# Altium project HW_ADHERENT_SYSCTRL_R1.PrjPcb (part 1 of 2)
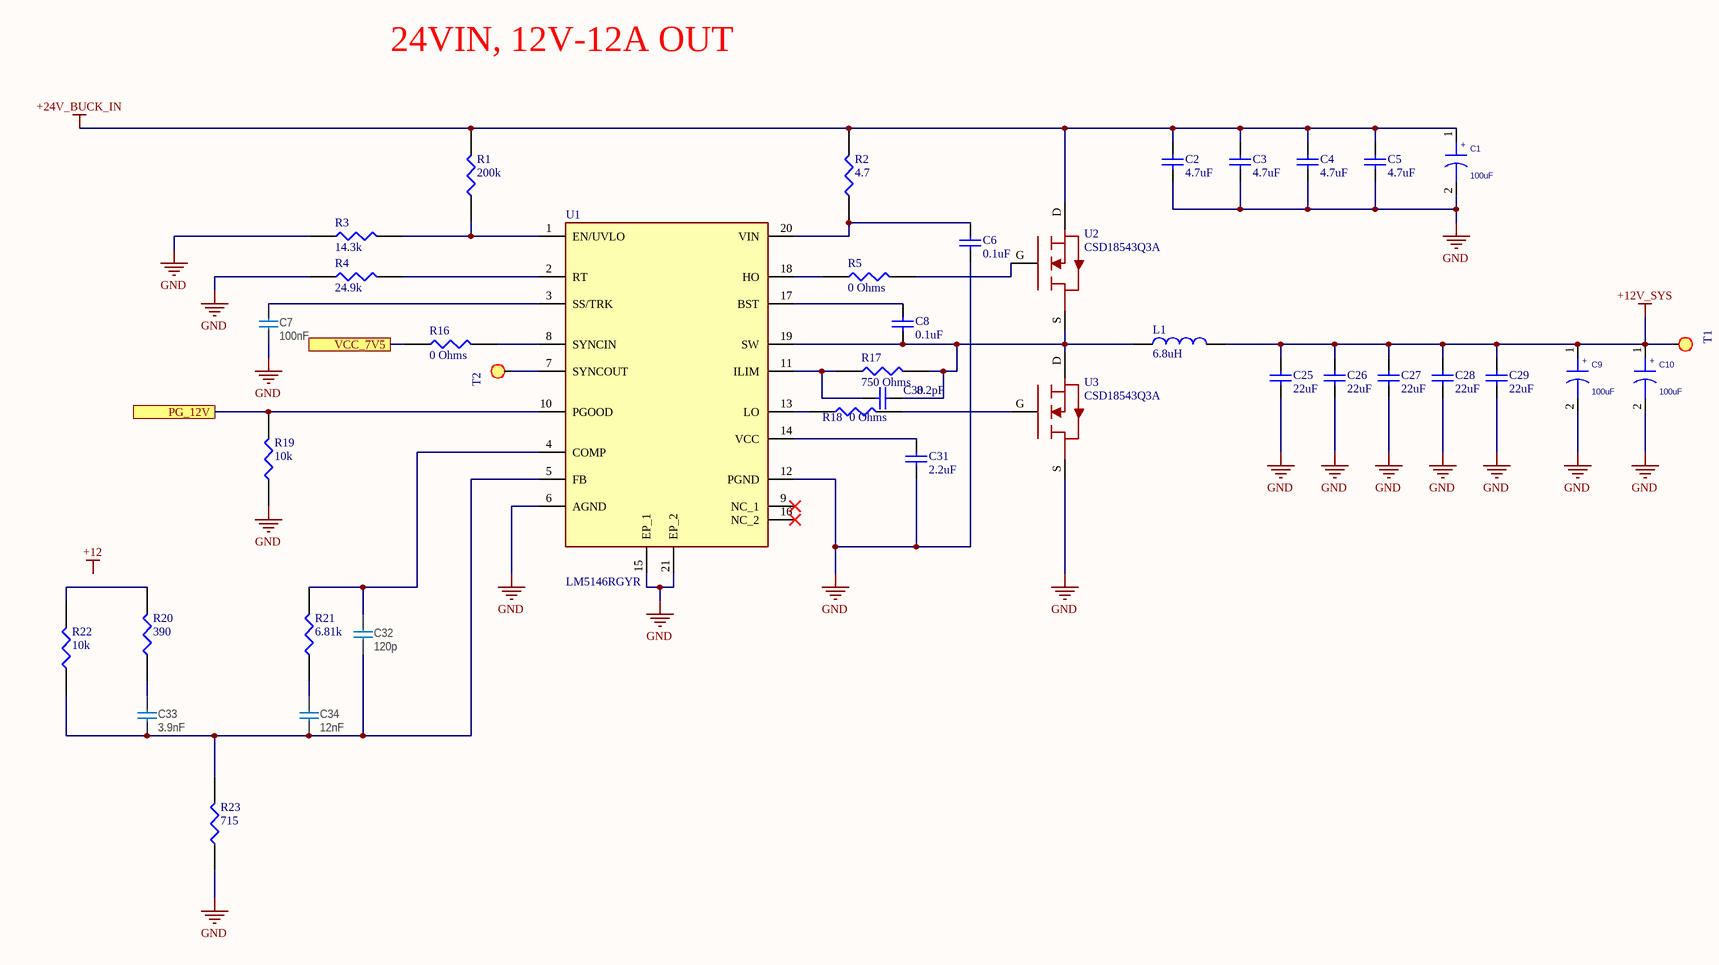
[diagram p0: 03_POWER1.SchDoc]
Project: HW_ADHERENT_SYSCTRL_R1; Title: HW_ADHERENT_SYSCTRL_R1; TitleParameter: HW_ADHERENT_SYSCTRL_R1
12 sheets, 218 parts. Net scope: flat (ports and power ports of the same name join across sheets).
Board file: HW_ADHERENT_SYSCTRL_R1.PcbDoc
Sheets:
  02_BLOCK_DIAGRAM.SchDoc
  03_POWER1.SchDoc
  04_POWER_2.SchDoc
  POWER_3.SchDoc
  POWER_4.SchDoc
  POWER_5.SchDoc
  05_MCU.SchDoc
  06_DRIVER.SchDoc
  DRIVER_2.SchDoc
  09_CONNECTOR.SchDoc
  DRIVER_3.SchDoc
  DRIVER4.SchDoc

## Sheet 02_BLOCK_DIAGRAM.SchDoc: HW_ADHERENT_SYSCTRL_R1
size A3; Organization: ASISGUARD; Address1: Kemalpasa, Kemalpasa Cd. No:290 D:292H, 35060 Bornova/Izmir/Turkey; SheetNumber: 2; SheetTotal: 6

### Notes on the sheet
- Proje/Project:
- Sayfa Adı/Document Name:
- Çizilme Tarihi/Drawing Date
- Umit KAYACIK
- Tasarlayan/Designed By
- Sayfa/Sheet:
- Revision:
- of
- Son Güncelleme/Last Edit Date
- Kontrol eden/Checked By
- Onaylayan/Approved By
- Boyut/Size:
- Varyant/Variant:
- Dil/Language:
- A3
- ENG

## Sheet 03_POWER1.SchDoc: HW_ADHERENT_SYSCTRL_R1
size A3; Organization: ASISGUARD; Address1: Kemalpasa, Kemalpasa Cd. No:290 D:292H, 35060 Bornova/Izmir/Turkey; SheetNumber: 3; SheetTotal: 14

### Parts
C1  100uF  [SMD 10.3x10.3x10.0mm]
C2  4.7uF  [CAP1206]
C3  4.7uF  [CAP1206]
C4  4.7uF  [CAP1206]
C5  4.7uF  [CAP1206]
C6  0.1uF  [0402_C]
C7  100nF  [CAPC0603X03L_C]
C8  0.1uF  [0402_C]
C9  100uF  [SMD 10.3x10.3x10.0mm]
C10  100uF  [SMD 10.3x10.3x10.0mm]
C25  22uF  [CAP1206]
C26  22uF  [CAP1206]
C27  22uF  [CAP1206]
C28  22uF  [CAP1206]
C29  22uF  [CAP1206]
C30  value 8.2pF  [SMC0603]  (hidden comment: CAP CER 8.2PF 50V C0G/NPO 0603)
C31  value 2.2uF  [SMC0603]  (hidden comment: CAP CER 4.7UF 25V X5R 0603)
C32  120p  [CAPC0603X03L_C]
C33  3.9nF  [CAPC0603X03L_C]
C34  12nF  [CAPC0603X03L_C]
L1  6.8uH  [SRU10386R2Y]
R1  200k  [0805]
R2  4.7  [0805]
R3  14.3k  [0805]
R4  24.9k  [0805]
R5  0 Ohms  [0805]
R16  0 Ohms  [0805]
R17  750 Ohms  [0805]
R18  0 Ohms  [0805]
R19  10k  [0805]
R20  390  [0805]
R21  6.81k  [0805]
R22  10k  [0805]
R23  715  [0805]
T1  SMD  [TEST_POINT]  (value not drawn)
T2  SMD  [TEST_POINT]  (value not drawn)
U1  LM5146RGYR  [LM5146RGYR]
U2  CSD18543Q3A  [CSD18543Q3A]
U3  CSD18543Q3A  [CSD18543Q3A]

### Ports
PG_12V, VCC_7V5

### Nets
+12V_SYS: C9.1 C10.1 C25.2 C26.2 C27.2 C28.2 C29.2 L1.2 T1.1(TP)
+24V_BUCK_IN: C1.1 C2.2 C3.2 C4.2 C5.2 R1.2 R2.2 U2.D
GND: C1.2 C2.1 C3.1 C4.1 C5.1 C6.1 C7.1 C9.2 C10.2 C25.1 C26.1 C27.1 C28.1 C29.1 C31.1 R3.1 R4.1 R19.1 R23.1 U1.6(AGND) U1.12(PGND) U1.15(EP_1) U1.21(EP_2) U3.S
NetC6_2: C6.2 R2.1 U1.20(VIN)
NetC7_2: C7.2 U1.3(SS/TRK)
NetC8_1: C8.1 C30.2 L1.1 R17.2 U1.19(SW) U2.S U3.D
NetC8_2: C8.2 U1.17(BST)
NetC30_1: C30.1 R17.1 U1.11(ILIM)
NetC31_2: C31.2 U1.14(VCC)
NetC32_1: C32.1 C33.1 C34.1 R22.1 R23.2 U1.5(FB)
NetC32_2: C32.2 R21.2 U1.4(COMP)
NetC33_2: C33.2 R20.1
NetC34_2: C34.2 R21.1
NetR1_1: R1.1 R3.2 U1.1(EN/UVLO)
NetR4_2: R4.2 U1.2(RT)
NetR5_1: R5.1 U1.18(HO)
NetR5_2: R5.2 U2.G
NetR16_1: R16.1 ; port VCC_7V5
NetR16_2: R16.2 U1.8(SYNCIN)
NetR18_1: R18.1 U1.13(LO)
NetR18_2: R18.2 U3.G
NetR19_2: R19.2 U1.10(PGOOD) ; port PG_12V
NetR20_2: R20.2 R22.2
NetT2_1: T2.1(TP) U1.7(SYNCOUT)

Not connected (* = marked no-connect by the designer): U1 9(NC_1)* 16(NC_2)*

### Notes on the sheet
- 24VIN, 12V-12A OUT
- Labels drawn without touching a wire or pin: +12
- Proje/Project:
- Sayfa Adı/Document Name:
- Çizilme Tarihi/Drawing Date
- Umit KAYACIK
- Tasarlayan/Designed By
- Sayfa/Sheet:
- Revision:
- of
- Son Güncelleme/Last Edit Date
- Kontrol eden/Checked By
- Onaylayan/Approved By
- Boyut/Size:
- Varyant/Variant:
- Dil/Language:
- A3
- ENG
- (in symbol 150uF-6.3V-20%-AL-LOESR-SMD_5x6_5) +

### Library data of the parts
C1 C9 C10 = 150uF-6.3V-20%-AL-LOESR-SMD_5x6_5: CAP ALUM POLY 100UF 20% 50V SMD; Manufacturer: Nichicon; Manufacturer Part Number: PCV1H101MCL2GS; Value: 100uF; Supplier Part Number: 493-4558-1-ND
C2-C5 = CAP1206_4.7uF_100V: 4.7 µF ±10% 100V Ceramic Capacitor X7S 1206 (3216 Metric); Manufacturer Part Number: 12061Z475KAT2A; Value: 4.7uF 100V; Order Code: DIGI : 445-180362-1-ND
C6 C8 = Cap: CAP CER 0.1UF 50V X7R 0402; Manufacturer: TDK Corporation; Manufacturer Part Number: C1005X7R1H104K050BB; Value: 0.1uF; Supplier Part Number: 445-5932-1-ND
C7 = C0201-100n: Capacitor, X5R, ±10%; Manufacturer: N.A.; Part number IPS: 00000001248, 00000002505; Part number Norautron: 262071862; Part number NEMS: 100200078; Note: 16V; Pad Count: 2; Component Status: Active; Part Number: C0201-100n; Manufacturer Part Number: N.A.; ComponentLink1URL: N.A.; ComponentLink1Description: Datasheet; ComponentLink2URL: N.A.; ComponentLink2Description: Supplier link; HelpURL: N.A.; Footprint Doc: 0201; LatestRevisionDate: 2017-11-09; Published: 2014-11-13; Value: 100nF; Supplier 1: N.A.; Supplier Part Number 1: N.A.; Supplier 2: N.A.; Supplier Part Number 2: N.A.; Artikkelnr Noca: N.A.; PartId: 100200078; Component Class: Capacitors; Author: rsk
C25-C29 = CAP1206_22uF_35V: 22 µF ±20% 35V Ceramic Capacitor X5R 1206 (3216 Metric); Manufacturer Part Number: C3216X5R1V226M160AC; Value: 22uF 35V; Order Code: DIGI : 445-180362-1-ND
C30 = CAP0603_8.2PF_50V: 8.2 pF ±0.25pF 50V Ceramic Capacitor C0G, NP0 0603 (1608 Metric); Manufacturer Part Number: CC0603CRNPO9BN8R2; Order Code: DIGI : 311-3865-2-ND; LCSC Manufacturer Part Number: CC0603CRNPO9BN8R2; LCSC Part Number: C277519
C31 = CAP0603_2.2UF_16V: 2.2 µF ±10% 16V Ceramic Capacitor X7S 0603 (1608 Metric); Manufacturer Part Number: GRT188C71C225KE13D; Order Code: DIGI: 490-GRT188C71C225KE13DTR-ND
C32-C34 = C0201-100n: Capacitor, X5R, ±10%; Manufacturer: N.A.; Part number IPS: 00000001248, 00000002505; Part number Norautron: 262071862; Part number NEMS: 100200078; Value: 100nF; Note: 16V; Pad Count: 2; Component Status: Active; Part Number: C0201-100n; Manufacturer Part Number: N.A.; ComponentLink1URL: N.A.; ComponentLink1Description: Datasheet; ComponentLink2URL: N.A.; ComponentLink2Description: Supplier link; HelpURL: N.A.; Footprint Doc: 0201; LatestRevisionDate: 2017-11-09; Published: 2014-11-13; Supplier 1: N.A.; Supplier Part Number 1: N.A.; Supplier 2: N.A.; Supplier Part Number 2: N.A.; Artikkelnr Noca: N.A.; PartId: 100200078; Component Class: Capacitors; Author: rsk
L1 = IND_6.2uH_4A: 6.2 µH Shielded Drum Core, Wirewound Inductor 4 A 16.5mOhm Nonstandard; Manufacturer_Name: Bourns; Manufacturer Part Number: SRU1038-6R2Y; Geometry.Height: 6.1mm; Mouser Part Number: 652-SRU1038-6R2Y; Mouser Price/Stock: https://www.mouser.co.uk/ProductDetail/Bourns/SRU1038-6R2Y?qs=q9ZR8LvBB%2FuBaClm0822pQ%3D%3D; Arrow Part Number: SRU1038-6R2Y; Arrow Price/Stock: https://www.arrow.com/en/products/sru1038-6r2y/bourns; Datasheet Link: https://www.mouser.com/datasheet/2/54/sru1038-1391493.pdf
R1-R5 R16-R23 = 0805W8F2003T5E: -55℃~+155℃ 125mW 150V 200kΩ Thick Film Resistor ±1% ±100ppm/℃ 0805 Chip Resistor - Surface Mount ROHS
T1 T2 = TP_15: DESIG: testing PAD; FAB: NA; VAL: NOT POPULATED; PCB Footprint: test0_8-smd; REF: NA
U1 = LM5146RGYR: Buck Regulator Positive Output Step-Down DC-DC Controller IC 20-VQFN (3.5x4.5); Manufacturer: Texas Instruments; Supplier: Digi; 296-LM5146RGYRDKR-ND
U2 U3 = CSD18543Q3A: N-Channel 60 V 60A (Tc) 66W (Tc) Surface Mount 8-VSONP (3x3.3)

## Sheet 04_POWER_2.SchDoc: HW_ADHERENT_SYSCTRL_R1
size A3; SheetNumber: 4; SheetTotal: 13
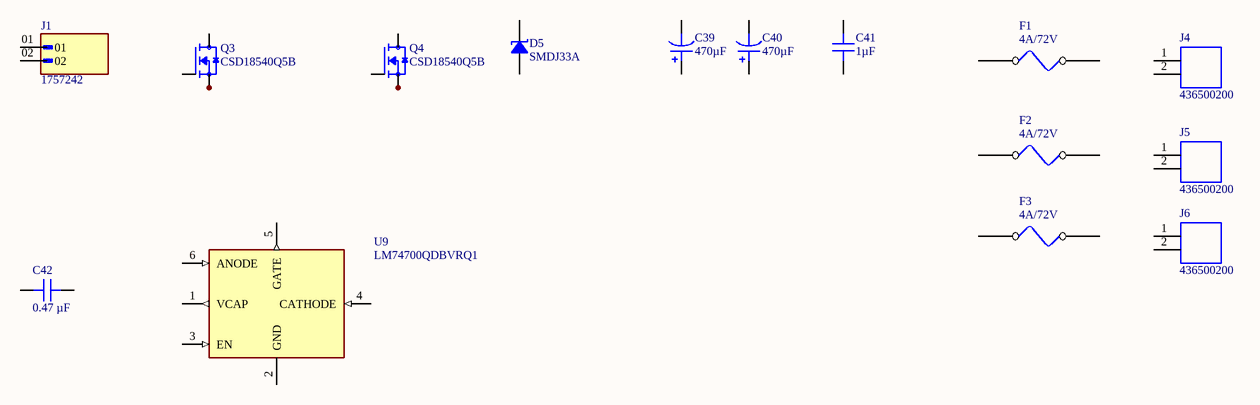
[diagram p1: 04_POWER_2.SchDoc]

### Parts
C39  470µF  [CAP TH ALUM ELEC D10.00mm S5.00mm H22.00mm]
C40  470µF  [CAP TH ALUM ELEC D10.00mm S5.00mm H22.00mm]
C41  1µF  [CAP 0805_2012]
C42  0.47 µF  [CAP 0603_1608]
D5  SMDJ33A  [DO214AB SMC]
F1  4A/72V  [F1206]
F2  4A/72V  [F1206]
F3  4A/72V  [F1206]
J1  1757242  [PHOENIX_1757242]
J4  436500200  [CONN_SD-43650-001_02_MOL]
J5  436500200  [CONN_SD-43650-001_02_MOL]
J6  436500200  [CONN_SD-43650-001_02_MOL]
Q3  CSD18540Q5B  [TRANS_CSD18540Q5B]
Q4  CSD18540Q5B  [TRANS_CSD18540Q5B]
U9  LM74700QDBVRQ1  [SOT95P280X145-6N/LM74700QDBVRQ1]

### Nets
NetQ3_1: Q3.1(S) Q3.2(S) Q3.3(S)
NetQ4_1: Q4.1(S) Q4.2(S) Q4.3(S)

Not connected (* = marked no-connect by the designer): C39 1 2; C40 1 2; C41 1 2; C42 1 2; D5 1 2; F1 1 2; F2 1 2; F3 1 2; J1 01 02; J4 1 2; J5 1 2; J6 1 2; Q3 4(G) 5_6_7_8(D); Q4 4(G) 5_6_7_8(D); U9 1(VCAP) 2(GND) 3(EN) 4(CATHODE) 5(GATE) 6(ANODE)

### Library data of the parts
C39 C40 = ECA-1HM471: CAP ALUM 470UF 20% 50V RADIAL; manufacturer: Panasonic Electronic Components; Lifetime @ Temp.: 2000 Hrs @ 85°C; Polarization: Polar; Ripple Current @ High Frequency: 1.105A @ 10kHz; Ripple Current @ Low Frequency: 650mA @ 120Hz; Part Number: ECA-1HM471; Applications: General Purpose; Capacitance: 470µF; componentlink1description: Datasheet; componentlink1url: //media.digikey.com/pdf/Data%20Sheets/Panasonic%20Electronic%20Components/ECA-xxM%20Series,TypeA.pdf; componentlink2description: DigiKey Link; componentlink2url: http://digikey.com/product-detail/en/panasonic-electronic-components/ECA-1HM471/P5185-ND/245044; Device Package: Radial, Can; Height - Seated (Max): 0.866" (22.00mm); lastupdated: 2.09.2020 01:31:40; Lead Spacing: 0.197" (5.00mm); Lifecycle Status: Active; Minimum Order: 1; Mounting Type: Through Hole; Operating Temperature: -40°C ~ 85°C; Package / Case: Radial, Can; packaging: Bulk; partid: 13256; Part Status: Active; price: 0.64; series: M; Size / Dimension: 0.394" Dia (10.00mm); Supplier 1: DigiKey; Supplier Part Number 1: P5185-ND; Tolerance: ±20%; value: 470µF; Voltage - Rated: 50V
C41 = 08051C105K4T2A: CAP CER 1UF 100V X7R 0805; manufacturer: AVX Corporation; Tolerance: ±10%; Part Number: 08051C105K4T2A; Capacitance: 1µF; Applications: Automotive; componentlink1description: Datasheet; componentlink1url: http://datasheets.avx.com/AutoMLCC.pdf; componentlink2description: DigiKey Link; componentlink2url: http://digikey.com/product-detail/en/avx-corporation/08051C105K4T2A/478-12142-1-ND/9374711; Device Package: 0805 (2012 Metric); lastupdated: 2.09.2020 01:04:22; Lifecycle Status: Active; Minimum Order: 1; Mounting Type: Surface Mount, MLCC; Operating Temperature: -55°C ~ 125°C; Package / Case: 0805 (2012 Metric); packaging: TapeAndReel; partid: 13414; Part Status: Active; price: 0.09; Ratings: AEC-Q200; series: -; Size / Dimension: 0.079" L x 0.049" W (2.01mm x 1.25mm); Supplier 1: DigiKey; Supplier Part Number 1: 478-12142-1-ND; Temperature Coefficient: X7R; value: 1µF; Voltage - Rated: 100V
C42 = CL10A474KA8NNNC: CAP CER 0.47UF 25V X5R 0603; manufacturer: Samsung Electro-Mechanics; Tolerance: ±10%; Part Number: CL10A474KA8NNNC; Capacitance: 0.47 µF; Applications: General Purpose; componentlink1description: Datasheet; componentlink1url: http://www.samsungsem.com/kr/support/product-search/mlcc/CL10A474KA8NNNC.jsp; componentlink2description: DigiKey Link; componentlink2url: https://www.digikey.com/en/products/detail/samsung-electro-mechanics/CL10A474KA8NNNC/3887553; Device Package: 0603 (1608 Metric); lastupdated: 6.04.2026 19:23:45; Lifecycle Status: Active; Minimum Order: 1; Mounting Type: Surface Mount, MLCC; Operating Temperature: -55°C ~ 85°C; Package / Case: 0603 (1608 Metric); packaging: TapeAndReel; partid: 4224; Part Status: Active; price: 0.01; series: CL; Size / Dimension: 0.063" L x 0.031" W (1.60mm x 0.80mm); Supplier 1: DigiKey; Supplier Part Number 1: 1276-1895-1-ND; Temperature Coefficient: X5R; Thickness (Max): 0.035" (0.90mm); value: 0.47 µF; Voltage - Rated: 25V
D5 = SMDJ33A: TVS DIODE 33VWM 53.3VC DO214AB; Manufacturer: Littelfuse Inc.; Current - Peak Pulse (10/1000µs): 56.3A; Power Line Protection: No; Power - Peak Pulse: 3000W (3kW); Type: Zener; Unidirectional Channels: 1; Voltage - Breakdown (Min): 36.7V; Voltage - Clamping (Max) @ Ipp: 53.3V; Voltage - Reverse Standoff (Typ): 33V; Part Number: SMDJ33A; Applications: General Purpose; ComponentLink1Description: Datasheet; ComponentLink1URL: https://www.littelfuse.com/~/media/electronics/datasheets/tvs_diodes/littelfuse_tvs_diode_smdj_datasheet.pdf.pdf; ComponentLink2Description: DigiKey Link; ComponentLink2URL: https://www.digikey.com/en/products/detail/littelfuse-inc/SMDJ33A/1835325; LastUpdated: 5.04.2026 20:34:02; Lifecycle Status: Active; Minimum Order: 1; Mounting Type: Surface Mount; Operating Temperature: -65°C ~ 150°C (TJ); Package / Case: DO-214AB, SMC; Packaging: TapeAndReel; PartId: 7128; Part Status: Active; Price: 0.33; Series: SMDJ; Supplier 1: DigiKey; Supplier Part Number 1: SMDJ33ACT-ND; Supplier Device Package: DO-214AB (SMCJ)
F1-F3 = Fuse: Fuse,Resettable 4A 75V,SMD 1206,TLC; Manufacturer P/N: F12F4; Myir P/N: 20801.00014; Datasheet: F12F Series.pdf; Reserve Value: 4A; Manufacturer: TLC; Part Type: Resettable Fuse; PCB Footprint: F1206
J1 = 1757242: Pluggable Header 5.08mm 12AWG 320V 12A 2 Position COMBICON MSTBA Series | Phoenix Contact 1757242; SnapEDA_Link: https://www.snapeda.com/parts/1757242/Phoenix+Contact/view-part/?ref=snap; Package: None; Value: *; MF: Phoenix Contact; MP: 1757242; Check_prices: https://www.snapeda.com/parts/1757242/Phoenix+Contact/view-part/?ref=eda
J4-J6 = 436500200: Connector Header Through Hole, Right Angle 2 position 0.118 (3.00mm); MF: Molex; SnapEDA_Link: https://www.snapeda.com/parts/436500200/Molex/view-part/?ref=snap; Package: None; Value: *; MP: 436500200; Check_prices: https://www.snapeda.com/parts/436500200/Molex/view-part/?ref=eda
Q3 Q4 = CSD18540Q5B: 60-V, N channel NexFETâ„¢ power MOSFET, single SON 5 mm x 6 mm, 2.2 mOhm; MF: Texas Instruments; SnapEDA_Link: https://www.snapeda.com/parts/CSD18540Q5B/Texas+Instruments/view-part/?ref=snap; Package: VSON-CLIP-8 Texas Instruments; Value: *; MP: CSD18540Q5B; Check_prices: https://www.snapeda.com/parts/CSD18540Q5B/Texas+Instruments/view-part/?ref=eda
U9 = LM74700QDBVRQ1: OR Controller N+1 ORing Controller N-Channel 1:1 SOT-23-6

## Sheet POWER_3.SchDoc: HW_ADHERENT_SYSCTRL_R1
size A; SheetNumber: 5; SheetTotal: 14
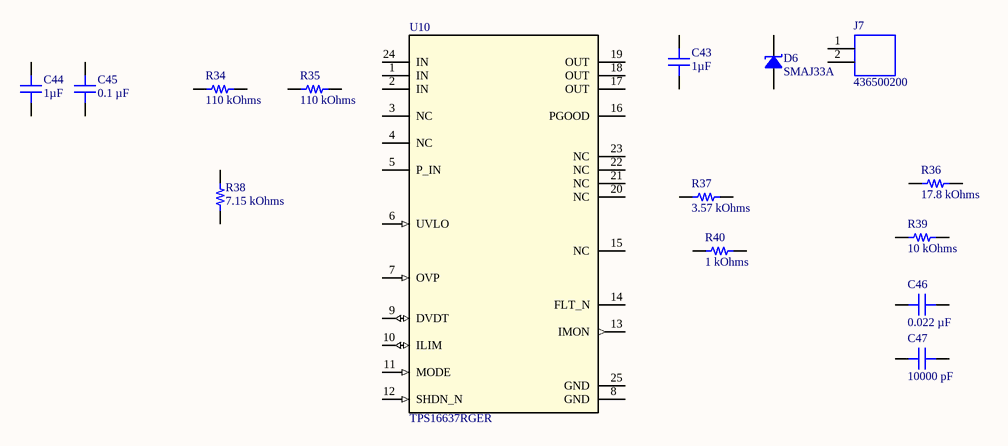
[diagram p2: POWER_3.SchDoc]

### Parts
C43  1µF  [CAP 0805_2012]
C44  1µF  [CAP 0805_2012]
C45  0.1 µF  [CAP 0603_1608]
C46  0.022 µF  [CAP 0603_1608]
C47  10000 pF  [CAP 0603_1608]
D6  SMAJ33A  [DO214AC SMA]
J7  436500200  [CONN_SD-43650-001_02_MOL]
R34  110 kOhms  [RES 0603_1608]
R35  110 kOhms  [RES 0603_1608]
R36  17.8 kOhms  [RES 0603_1608]
R37  3.57 kOhms  [RES 0603_1608]
R38  7.15 kOhms  [RES 0603_1608]
R39  10 kOhms  [RES 0603_1608]
R40  1 kOhms  [RES 0603_1608]
U10  TPS16637RGER  [RGE0024H]

### Nets

Not connected (* = marked no-connect by the designer): C43 1 2; C44 1 2; C45 1 2; C46 1 2; C47 1 2; D6 1 2; J7 1 2; R34 1 2; R35 1 2; R36 1 2; R37 1 2; R38 1 2; R39 1 2; R40 1 2; U10 1(IN) 2(IN) 3(NC) 4(NC) 5(P_IN) 6(UVLO) 7(OVP) 8(GND) 9(DVDT) 10(ILIM) 11(MODE) 12(SHDN_N) 13(IMON) 14(FLT_N) 15(NC) 16(PGOOD) 17(OUT) 18(OUT) 19(OUT) 20(NC) 21(NC) 22(NC) 23(NC) 24(IN) 25(GND)

### Library data of the parts
C43 C44 = 08051C105K4T2A: as C41 on sheet 04_POWER_2; Part Number: 08051C105K4T2A; Capacitance: 1µF; Applications: Automotive; componentlink1description: Datasheet; componentlink1url: http://datasheets.avx.com/AutoMLCC.pdf; componentlink2description: DigiKey Link; componentlink2url: http://digikey.com/product-detail/en/avx-corporation/08051C105K4T2A/478-12142-1-ND/9374711; Device Package: 0805 (2012 Metric); lastupdated: 2.09.2020 01:04:22; Lifecycle Status: Active; Minimum Order: 1; Mounting Type: Surface Mount, MLCC; Operating Temperature: -55°C ~ 125°C; Package / Case: 0805 (2012 Metric); packaging: TapeAndReel; partid: 13414; Part Status: Active; price: 0.09; Ratings: AEC-Q200; series: -; Size / Dimension: 0.079" L x 0.049" W (2.01mm x 1.25mm); Supplier 1: DigiKey; Supplier Part Number 1: 478-12142-1-ND; Temperature Coefficient: X7R; value: 1µF; Voltage - Rated: 100V
C45 = HMK107BJ104KA-T: CAP CER 0.1UF 100V X5R 0603; manufacturer: Taiyo Yuden; Tolerance: ±10%; Part Number: HMK107BJ104KA-T; Capacitance: 0.1 µF; Applications: SMPS Filtering; componentlink1description: Datasheet; componentlink1url: https://ds.yuden.co.jp/TYCOMPAS/ut/detail?pn=HMK107BJ104KA-T  &u=M; componentlink2description: DigiKey Link; componentlink2url: https://www.digikey.com/en/products/detail/taiyo-yuden/HMK107BJ104KA-T/4970694; Device Package: 0603 (1608 Metric); Features: High Voltage; lastupdated: 6.04.2026 19:23:31; Lifecycle Status: Active; Minimum Order: 1; Mounting Type: Surface Mount, MLCC; Operating Temperature: -55°C ~ 85°C; Package / Case: 0603 (1608 Metric); packaging: TapeAndReel; partid: 8162; Part Status: Active; price: 0.01; series: M; Size / Dimension: 0.063" L x 0.031" W (1.60mm x 0.80mm); Supplier 1: DigiKey; Supplier Part Number 1: 587-5862-1-ND; Temperature Coefficient: X5R; Thickness (Max): 0.035" (0.90mm); value: 0.1 µF; Voltage - Rated: 100V
C46 = CL10B223KO8WPNC: CAP CER 22NF 16V X7R 0603; manufacturer: Samsung Electro-Mechanics; Tolerance: ±10%; Part Number: CL10B223KO8WPNC; Capacitance: 0.022 µF; Applications: Automotive; componentlink1description: Datasheet; componentlink1url: https://mm.digikey.com/Volume0/opasdata/d220001/medias/docus/5458/CL10B223KO8WPNC_Spec.pdf; componentlink2description: DigiKey Link; componentlink2url: https://www.digikey.com/en/products/detail/samsung-electro-mechanics/CL10B223KO8WPNC/20498563; Device Package: 0603 (1608 Metric); Features: Open Mode; lastupdated: 6.04.2026 19:17:38; Lifecycle Status: Active; Minimum Order: 1; Mounting Type: Surface Mount, MLCC, Epoxy; Operating Temperature: -55°C ~ 125°C; Package / Case: 0603 (1608 Metric); packaging: TapeAndReel; partid: 64880; price: 0.01; Ratings: AEC-Q200; series: CL; Size / Dimension: 0.063" L x 0.031" W (1.60mm x 0.80mm); Supplier 1: DigiKey; Supplier Part Number 1: 1276-CL10B223KO8WPNCCT-ND; Temperature Coefficient: X7R; Thickness (Max): 0.035" (0.88mm); value: 0.022 µF; Voltage - Rated: 16V
C47 = C0603C103M4REC7411: CAP CER 0603 10NF 16V X7R 20%; manufacturer: KEMET; Part Number: C0603C103M4REC7411; Capacitance: 10000 pF; Applications: ESD Protection; componentlink1description: Datasheet; componentlink1url: https://connect.kemet.com:7667/gateway/IntelliData-ComponentDocumentation/1.0/download/datasheet/C0603C103M4REC7411; componentlink2description: DigiKey Link; componentlink2url: https://www.digikey.com/en/products/detail/kemet/C0603C103M4REC7411/8645113; Device Package: 0603 (1608 Metric); lastupdated: 6.04.2026 19:20:47; Lifecycle Status: Active; Minimum Order: 1; Mounting Type: Surface Mount, MLCC; Operating Temperature: -55°C ~ 125°C; Package / Case: 0603 (1608 Metric); packaging: TapeAndReel; partid: 52195; Part Status: Active; price: 0.01; series: ESD SMD Comm X7R; Size / Dimension: 0.063" L x 0.031" W (1.60mm x 0.80mm); Supplier 1: DigiKey; Supplier Part Number 1: 399-C0603C103M4REC7411CT-ND; Temperature Coefficient: X7R; Thickness (Max): 0.034" (0.87mm); Tolerance: ±20%; value: 10000 pF; Voltage - Rated: 16V
D6 = SMAJ33A: TVS DIODE 33VWM 53.3VC DO214AC; Manufacturer: Littelfuse Inc.; Current - Peak Pulse (10/1000µs): 7.5A; Power Line Protection: No; Power - Peak Pulse: 400W; Type: Zener; Unidirectional Channels: 1; Voltage - Breakdown (Min): 36.7V; Voltage - Clamping (Max) @ Ipp: 53.3V; Voltage - Reverse Standoff (Typ): 33V; Part Number: SMAJ33A; Applications: General Purpose; ComponentLink1Description: Datasheet; ComponentLink1URL: https://www.littelfuse.com/~/media/electronics/datasheets/tvs_diodes/littelfuse_tvs_diode_smaj_datasheet.pdf.pdf; ComponentLink2Description: DigiKey Link; ComponentLink2URL: https://www.digikey.com/en/products/detail/littelfuse-inc/SMAJ33A/762296; LastUpdated: 5.04.2026 20:34:16; Lifecycle Status: Active; Minimum Order: 1; Mounting Type: Surface Mount; Operating Temperature: -65°C ~ 150°C (TJ); Package / Case: DO-214AC, SMA; Packaging: TapeAndReel; PartId: 5718; Part Status: Active; Price: 0.06; Series: SMAJ; Supplier 1: DigiKey; Supplier Part Number 1: SMAJ33ALFCT-ND; Supplier Device Package: DO-214AC (SMA)
J7 = 436500200: as J4 on sheet 04_POWER_2; SnapEDA_Link: https://www.snapeda.com/parts/436500200/Molex/view-part/?ref=snap; Package: None; Value: *; MP: 436500200; Check_prices: https://www.snapeda.com/parts/436500200/Molex/view-part/?ref=eda
R34 R35 = RMCF0603FT110K: RES 110K OHM 1% 1/10W 0603; Manufacturer: Stackpole Electronics Inc; Power (Watts): 0.1W, 1/10W; Temperature Coefficient: ±100ppm/°C; Part Number: RMCF0603FT110K; Value: 110 kOhms; ComponentLink1Description: Datasheet; ComponentLink1URL: https://www.seielect.com/catalog/sei-packaging.pdf; ComponentLink2Description: DigiKey Link; ComponentLink2URL: https://www.digikey.com/en/products/detail/stackpole-electronics-inc/RMCF0603FT110K/1761310; Composition: Thick Film; Device Package: 0603 (1608 Metric); Features: Automotive AEC-Q200; Height - Seated (Max): 0.022" (0.55mm); LastUpdated: 9.02.2024 20:43:13; Lifecycle Status: Active; Minimum Order: 1; Number of Terminations: 2; Operating Temperature: -55°C ~ 155°C; Package / Case: 0603 (1608 Metric); Packaging: CutTape; PartId: 10728; Part Status: Active; Price: 0.01; Ratings: AEC-Q200; Resistance: 110 kOhms; Series: RMCF; Size / Dimension: 0.061" L x 0.031" W (1.55mm x 0.80mm); Supplier 1: DigiKey; Supplier Part Number 1: RMCF0603FT110KCT-ND; Supplier Device Package: 0603; Tolerance: ±1%
R36 = RMCF0603FG17K8: RES 17.8K OHM 1% 1/10W 0603; Manufacturer: Stackpole Electronics Inc; Power (Watts): 0.1W, 1/10W; Temperature Coefficient: ±100ppm/°C; Part Number: RMCF0603FG17K8; Value: 17.8 kOhms; ComponentLink1Description: Datasheet; ComponentLink1URL: https://www.seielect.com/catalog/sei-rmcf_rmcp.pdf; ComponentLink2Description: DigiKey Link; ComponentLink2URL: https://www.digikey.com/en/products/detail/stackpole-electronics-inc/RMCF0603FG17K8/1713668; Composition: Thick Film; Device Package: 0603 (1608 Metric); Features: Automotive AEC-Q200; Height - Seated (Max): 0.022" (0.55mm); LastUpdated: 9.02.2024 20:42:38; Lifecycle Status: Active; Minimum Order: 1; Number of Terminations: 2; Operating Temperature: -55°C ~ 155°C; Package / Case: 0603 (1608 Metric); Packaging: CutTape; PartId: 19862; Part Status: Active; Price: 0.01; Ratings: AEC-Q200; Resistance: 17.8 kOhms; Series: RMCF; Size / Dimension: 0.061" L x 0.031" W (1.55mm x 0.80mm); Supplier 1: DigiKey; Supplier Part Number 1: RMCF0603FG17K8CT-ND; Supplier Device Package: 0603; Tolerance: ±1%
R37 = RMCF0603FT3K57: RES 3.57K OHM 1% 1/10W 0603; Manufacturer: Stackpole Electronics Inc; Power (Watts): 0.1W, 1/10W; Temperature Coefficient: ±100ppm/°C; Part Number: RMCF0603FT3K57; Value: 3.57 kOhms; ComponentLink1Description: Datasheet; ComponentLink1URL: https://www.seielect.com/catalog/sei-rmcf_rmcp.pdf; ComponentLink2Description: DigiKey Link; ComponentLink2URL: https://www.digikey.com/en/products/detail/stackpole-electronics-inc/RMCF0603FT3K57/1761029; Composition: Thick Film; Device Package: 0603 (1608 Metric); Features: Automotive AEC-Q200; Height - Seated (Max): 0.022" (0.55mm); LastUpdated: 9.02.2024 20:42:52; Lifecycle Status: Active; Minimum Order: 1; Number of Terminations: 2; Operating Temperature: -55°C ~ 155°C; Package / Case: 0603 (1608 Metric); Packaging: CutTape; PartId: 16325; Part Status: Active; Price: 0.01; Ratings: AEC-Q200; Resistance: 3.57 kOhms; Series: RMCF; Size / Dimension: 0.061" L x 0.031" W (1.55mm x 0.80mm); Supplier 1: DigiKey; Supplier Part Number 1: RMCF0603FT3K57CT-ND; Supplier Device Package: 0603; Tolerance: ±1%
R38 = RMCF0603FT7K15: RES 7.15K OHM 1% 1/10W 0603; Manufacturer: Stackpole Electronics Inc; Power (Watts): 0.1W, 1/10W; Temperature Coefficient: ±100ppm/°C; Part Number: RMCF0603FT7K15; Value: 7.15 kOhms; ComponentLink1Description: Datasheet; ComponentLink1URL: https://www.seielect.com/catalog/sei-packaging.pdf; ComponentLink2Description: DigiKey Link; ComponentLink2URL: https://www.digikey.com/en/products/detail/stackpole-electronics-inc/RMCF0603FT7K15/1760937; Composition: Thick Film; Device Package: 0603 (1608 Metric); Features: Automotive AEC-Q200; Height - Seated (Max): 0.022" (0.55mm); LastUpdated: 9.02.2024 20:42:27; Lifecycle Status: Active; Minimum Order: 1; Number of Terminations: 2; Operating Temperature: -55°C ~ 155°C; Package / Case: 0603 (1608 Metric); Packaging: CutTape; PartId: 22551; Part Status: Active; Price: 0.01; Ratings: AEC-Q200; Resistance: 7.15 kOhms; Series: RMCF; Size / Dimension: 0.061" L x 0.031" W (1.55mm x 0.80mm); Supplier 1: DigiKey; Supplier Part Number 1: RMCF0603FT7K15CT-ND; Supplier Device Package: 0603; Tolerance: ±1%
R39 = RMCF0603FT10K0: RES 10K OHM 1% 1/10W 0603; Manufacturer: Stackpole Electronics Inc; Power (Watts): 0.1W, 1/10W; Temperature Coefficient: ±100ppm/°C; Part Number: RMCF0603FT10K0; Value: 10 kOhms; ComponentLink1Description: Datasheet; ComponentLink1URL: https://www.seielect.com/catalog/sei-rmcf_rmcp.pdf; ComponentLink2Description: DigiKey Link; ComponentLink2URL: https://www.digikey.com/en/products/detail/stackpole-electronics-inc/RMCF0603FT10K0/1761235; Composition: Thick Film; Device Package: 0603 (1608 Metric); Features: Automotive AEC-Q200; Height - Seated (Max): 0.022" (0.55mm); LastUpdated: 9.02.2024 20:42:00; Lifecycle Status: Active; Minimum Order: 1; Number of Terminations: 2; Operating Temperature: -55°C ~ 155°C; Package / Case: 0603 (1608 Metric); Packaging: CutTape; PartId: 25663; Part Status: Active; Price: 0.01; Ratings: AEC-Q200; Resistance: 10 kOhms; Series: RMCF; Size / Dimension: 0.061" L x 0.031" W (1.55mm x 0.80mm); Supplier 1: DigiKey; Supplier Part Number 1: RMCF0603FT10K0CT-ND; Supplier Device Package: 0603; Tolerance: ±1%
R40 = RMCF0603FG1K00: RES 1K OHM 1% 1/10W 0603; Manufacturer: Stackpole Electronics Inc; Power (Watts): 0.1W, 1/10W; Temperature Coefficient: ±100ppm/°C; Part Number: RMCF0603FG1K00; Value: 1 kOhms; ComponentLink1Description: Datasheet; ComponentLink1URL: https://www.seielect.com/catalog/sei-packaging.pdf; ComponentLink2Description: DigiKey Link; ComponentLink2URL: https://www.digikey.com/en/products/detail/stackpole-electronics-inc/RMCF0603FG1K00/1713699; Composition: Thick Film; Device Package: 0603 (1608 Metric); Features: Automotive AEC-Q200; Height - Seated (Max): 0.022" (0.55mm); LastUpdated: 9.02.2024 20:42:15; Lifecycle Status: Active; Minimum Order: 1; Number of Terminations: 2; Operating Temperature: -55°C ~ 155°C; Package / Case: 0603 (1608 Metric); Packaging: CutTape; PartId: 24034; Part Status: Active; Price: 0.01; Ratings: AEC-Q200; Resistance: 1 kOhms; Series: RMCF; Size / Dimension: 0.061" L x 0.031" W (1.55mm x 0.80mm); Supplier 1: DigiKey; Supplier Part Number 1: RMCF0603FG1K00CT-ND; Supplier Device Package: 0603; Tolerance: ±1%
U10 = TPS16637RGER: 4.5-V to 60-V, 31mÎ©, 0.6-6A eFuse with output power limiting 24-VQFN -40 to 125; Manufacturer_Name: Texas Instruments; TYPE: TYPE; RefDes: RefDes; Copyright: Copyright (C) 2025 Ultra Librarian. All rights reserved.; Manufacturer_Part_Number: TPS16637RGER

## Sheet POWER_4.SchDoc: HW_ADHERENT_SYSCTRL_R1
size A; SheetNumber: 6; SheetTotal: 13
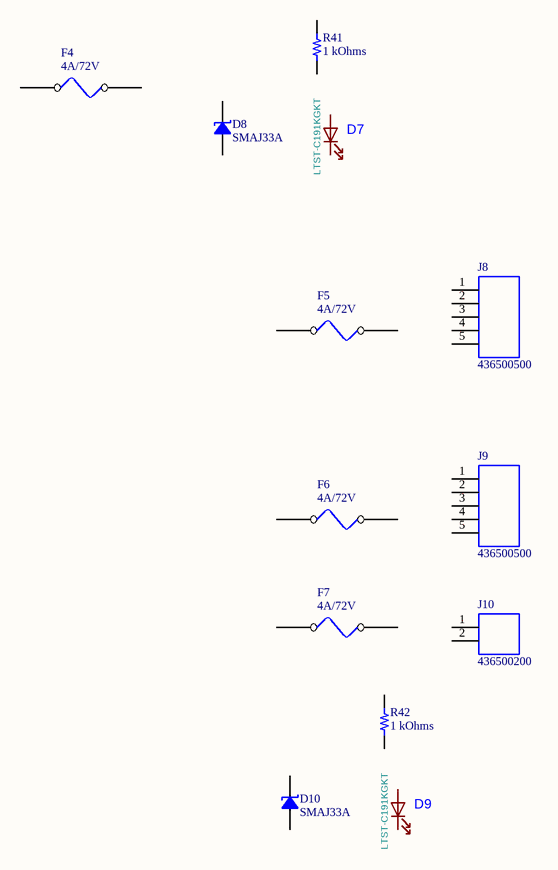
[diagram p3: POWER_4.SchDoc]

### Parts
D7  LTST-C191KGKT  [LED0603]
D8  SMAJ33A  [DO214AC SMA]
D9  LTST-C191KGKT  [LED0603]
D10  SMAJ33A  [DO214AC SMA]
F4  4A/72V  [F1206]
F5  4A/72V  [F1206]
F6  4A/72V  [F1206]
F7  4A/72V  [F1206]
J8  436500500  [CONN_SD-43650-001_05_MOL]
J9  436500500  [CONN_SD-43650-001_05_MOL]
J10  436500200  [CONN_SD-43650-001_02_MOL]
R41  1 kOhms  [RES 0603_1608]
R42  1 kOhms  [RES 0603_1608]

### Nets

Not connected (* = marked no-connect by the designer): D7 1(A) 2(K); D8 1 2; D9 1(A) 2(K); D10 1 2; F4 1 2; F5 1 2; F6 1 2; F7 1 2; J8 1 2 3 4 5; J9 1 2 3 4 5; J10 1 2; R41 1 2; R42 1 2

### Library data of the parts
D7 D9 = LED: LED, Bright Green, 0603; Manufacturer: Lite-On Inc.; Footprint: LED_SMD:LED_0603_1608Metric; Manufacturer Part Number: LTST-C191KGKT; Supplier Part Number: 160-1446-1-ND; Value: LTST-C191KGKT
D8 D10 = SMAJ33A: as D6 on sheet POWER_3; Part Number: SMAJ33A; Applications: General Purpose; ComponentLink1Description: Datasheet; ComponentLink1URL: https://www.littelfuse.com/~/media/electronics/datasheets/tvs_diodes/littelfuse_tvs_diode_smaj_datasheet.pdf.pdf; ComponentLink2Description: DigiKey Link; ComponentLink2URL: https://www.digikey.com/en/products/detail/littelfuse-inc/SMAJ33A/762296; LastUpdated: 5.04.2026 20:34:16; Lifecycle Status: Active; Minimum Order: 1; Mounting Type: Surface Mount; Operating Temperature: -65°C ~ 150°C (TJ); Package / Case: DO-214AC, SMA; Packaging: TapeAndReel; PartId: 5718; Part Status: Active; Price: 0.06; Series: SMAJ; Supplier 1: DigiKey; Supplier Part Number 1: SMAJ33ALFCT-ND; Supplier Device Package: DO-214AC (SMA)
F4-F7 = Fuse: as F1 on sheet 04_POWER_2; Datasheet: F12F Series.pdf; Reserve Value: 4A; Manufacturer: TLC; Part Type: Resettable Fuse; PCB Footprint: F1206
J8 J9 = 436500500: Connector Header Through Hole, Right Angle 5 position 0.118 (3.00mm); MF: Molex; SnapEDA_Link: https://www.snapeda.com/parts/436500500/Molex/view-part/?ref=snap; Package: None; Value: *; MP: 436500500; Check_prices: https://www.snapeda.com/parts/436500500/Molex/view-part/?ref=eda
J10 = 436500200: as J4 on sheet 04_POWER_2; SnapEDA_Link: https://www.snapeda.com/parts/436500200/Molex/view-part/?ref=snap; Package: None; Value: *; MP: 436500200; Check_prices: https://www.snapeda.com/parts/436500200/Molex/view-part/?ref=eda
R41 R42 = RMCF0603FG1K00: as R40 on sheet POWER_3; Part Number: RMCF0603FG1K00; Value: 1 kOhms; ComponentLink1Description: Datasheet; ComponentLink1URL: https://www.seielect.com/catalog/sei-packaging.pdf; ComponentLink2Description: DigiKey Link; ComponentLink2URL: https://www.digikey.com/en/products/detail/stackpole-electronics-inc/RMCF0603FG1K00/1713699; Composition: Thick Film; Device Package: 0603 (1608 Metric); Features: Automotive AEC-Q200; Height - Seated (Max): 0.022" (0.55mm); LastUpdated: 9.02.2024 20:42:15; Lifecycle Status: Active; Minimum Order: 1; Number of Terminations: 2; Operating Temperature: -55°C ~ 155°C; Package / Case: 0603 (1608 Metric); Packaging: CutTape; PartId: 24034; Part Status: Active; Price: 0.01; Ratings: AEC-Q200; Resistance: 1 kOhms; Series: RMCF; Size / Dimension: 0.061" L x 0.031" W (1.55mm x 0.80mm); Supplier 1: DigiKey; Supplier Part Number 1: RMCF0603FG1K00CT-ND; Supplier Device Package: 0603; Tolerance: ±1%

## Sheet POWER_5.SchDoc: HW_ADHERENT_SYSCTRL_R1
size A3; SheetNumber: 7; SheetTotal: 13
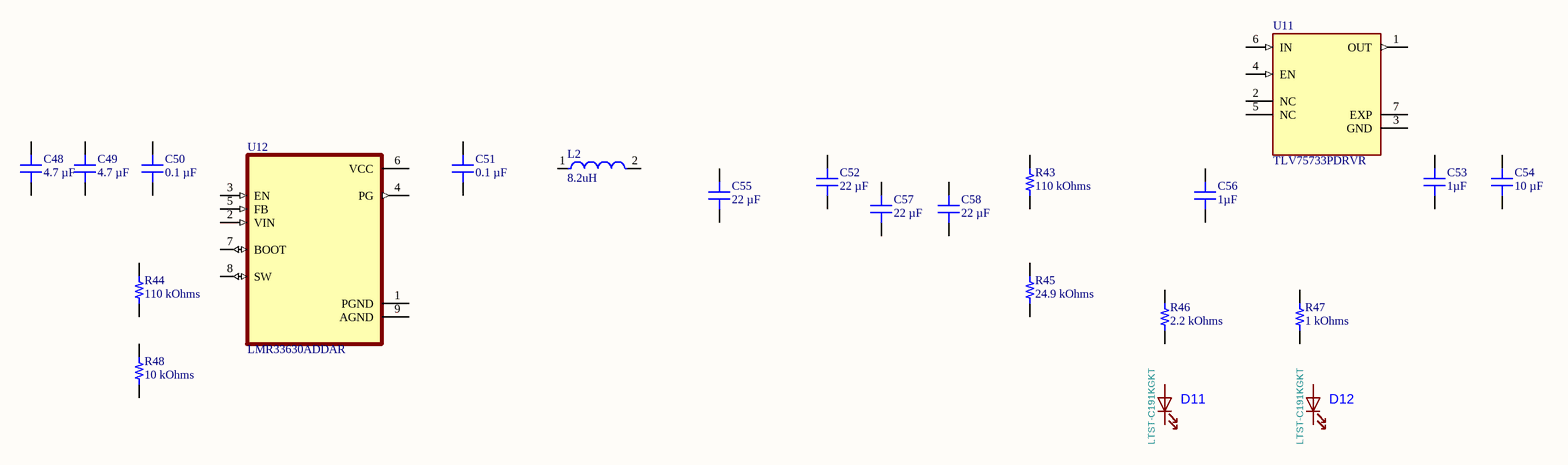
[diagram p4: POWER_5.SchDoc]

### Parts
C48  4.7 µF  [CAP 0603_1608]
C49  4.7 µF  [CAP 0603_1608]
C50  0.1 µF  [CAP 0603_1608]
C51  0.1 µF  [CAP 0603_1608]
C52  22 µF  [CAP 0603_1608]
C53  1µF  [CAP 0805_2012]
C54  10 µF  [CAP 0603_1608]
C55  22 µF  [CAP 0603_1608]
C56  1µF  [CAP 0805_2012]
C57  22 µF  [CAP 0603_1608]
C58  22 µF  [CAP 0603_1608]
D11  LTST-C191KGKT  [LED0603]
D12  LTST-C191KGKT  [LED0603]
L2  value 8.2uH  [Vishay_IHLP-2525CZ-FP_2_413x3_429-3D_3_0_MFG]  (hidden comment: FIXED IND 8.2UH 4A 68 MOHM SMD)
R43  110 kOhms  [RES 0603_1608]
R44  110 kOhms  [RES 0603_1608]
R45  24.9 kOhms  [RES 0603_1608]
R46  2.2 kOhms  [RES 0603_1608]
R47  1 kOhms  [RES 0603_1608]
R48  10 kOhms  [RES 0603_1608]
U11  TLV75733PDRVR  [VREG_TLV75733PDRVR]
U12  LMR33630ADDAR  [VREG_LM5017MR/NOPB]

### Nets

Not connected (* = marked no-connect by the designer): C48 1 2; C49 1 2; C50 1 2; C51 1 2; C52 1 2; C53 1 2; C54 1 2; C55 1 2; C56 1 2; C57 1 2; C58 1 2; D11 1(A) 2(K); D12 1(A) 2(K); L2 1 2; R43 1 2; R44 1 2; R45 1 2; R46 1 2; R47 1 2; R48 1 2; U11 1(OUT) 2(NC) 3(GND) 4(EN) 5(NC) 6(IN) 7(EXP); U12 1(PGND) 2(VIN) 3(EN) 4(PG) 5(FB) 6(VCC) 7(BOOT) 8(SW) 9(AGND)

### Library data of the parts
C48 C49 = CL10A475KL8NRNC: CAP CER 4.7UF 35V X5R 0603; manufacturer: Samsung Electro-Mechanics; Tolerance: ±10%; Part Number: CL10A475KL8NRNC; Capacitance: 4.7 µF; Applications: General Purpose; componentlink1description: Datasheet; componentlink1url: http://www.samsungsem.com/kr/support/product-search/mlcc/CL10A475KL8NRNC.jsp; componentlink2description: DigiKey Link; componentlink2url: https://www.digikey.com/en/products/detail/samsung-electro-mechanics/CL10A475KL8NRNC/5961278; Device Package: 0603 (1608 Metric); lastupdated: 6.04.2026 19:23:51; Lifecycle Status: Active; Minimum Order: 1; Mounting Type: Surface Mount, MLCC; Operating Temperature: -55°C ~ 85°C; Package / Case: 0603 (1608 Metric); packaging: TapeAndReel; partid: 2652; Part Status: Active; price: 0.08; series: CL; Size / Dimension: 0.063" L x 0.031" W (1.60mm x 0.80mm); Supplier 1: DigiKey; Supplier Part Number 1: 1276-6794-1-ND; Temperature Coefficient: X5R; Thickness (Max): 0.035" (0.90mm); value: 4.7 µF; Voltage - Rated: 35V
C50 C51 = HMK107BJ104KA-T: as C45 on sheet POWER_3; Part Number: HMK107BJ104KA-T; Capacitance: 0.1 µF; Applications: SMPS Filtering; componentlink1description: Datasheet; componentlink1url: https://ds.yuden.co.jp/TYCOMPAS/ut/detail?pn=HMK107BJ104KA-T  &u=M; componentlink2description: DigiKey Link; componentlink2url: https://www.digikey.com/en/products/detail/taiyo-yuden/HMK107BJ104KA-T/4970694; Device Package: 0603 (1608 Metric); Features: High Voltage; lastupdated: 6.04.2026 19:23:31; Lifecycle Status: Active; Minimum Order: 1; Mounting Type: Surface Mount, MLCC; Operating Temperature: -55°C ~ 85°C; Package / Case: 0603 (1608 Metric); packaging: TapeAndReel; partid: 8162; Part Status: Active; price: 0.01; series: M; Size / Dimension: 0.063" L x 0.031" W (1.60mm x 0.80mm); Supplier 1: DigiKey; Supplier Part Number 1: 587-5862-1-ND; Temperature Coefficient: X5R; Thickness (Max): 0.035" (0.90mm); value: 0.1 µF; Voltage - Rated: 100V
C52 C55 C57 C58 = CL10A226MP8NRNC: CAP CER 22UF 10V X5R 0603; manufacturer: Samsung Electro-Mechanics; Tolerance: ±20%; Part Number: CL10A226MP8NRNC; Capacitance: 22 µF; Applications: General Purpose; componentlink1description: Datasheet; componentlink1url: https://mm.digikey.com/Volume0/opasdata/d220001/medias/docus/339/CL10A226MP8NRNC_Spec.pdf; componentlink2description: DigiKey Link; componentlink2url: https://www.digikey.com/en/products/detail/samsung-electro-mechanics/CL10A226MP8NRNC/10478990; Device Package: 0603 (1608 Metric); lastupdated: 6.04.2026 19:18:15; Lifecycle Status: Active; Minimum Order: 1; Mounting Type: Surface Mount, MLCC; Operating Temperature: -55°C ~ 85°C; Package / Case: 0603 (1608 Metric); packaging: TapeAndReel; partid: 67717; price: 0.06; series: CL; Size / Dimension: 0.063" L x 0.031" W (1.60mm x 0.80mm); Supplier 1: DigiKey; Supplier Part Number 1: 1276-CL10A226MP8NRNCCT-ND; Temperature Coefficient: X5R; Thickness (Max): 0.039" (1.00mm); value: 22 µF; Voltage - Rated: 10V
C53 C56 = 08051C105K4T2A: as C41 on sheet 04_POWER_2; Part Number: 08051C105K4T2A; Capacitance: 1µF; Applications: Automotive; componentlink1description: Datasheet; componentlink1url: http://datasheets.avx.com/AutoMLCC.pdf; componentlink2description: DigiKey Link; componentlink2url: http://digikey.com/product-detail/en/avx-corporation/08051C105K4T2A/478-12142-1-ND/9374711; Device Package: 0805 (2012 Metric); lastupdated: 2.09.2020 01:04:22; Lifecycle Status: Active; Minimum Order: 1; Mounting Type: Surface Mount, MLCC; Operating Temperature: -55°C ~ 125°C; Package / Case: 0805 (2012 Metric); packaging: TapeAndReel; partid: 13414; Part Status: Active; price: 0.09; Ratings: AEC-Q200; series: -; Size / Dimension: 0.079" L x 0.049" W (2.01mm x 1.25mm); Supplier 1: DigiKey; Supplier Part Number 1: 478-12142-1-ND; Temperature Coefficient: X7R; value: 1µF; Voltage - Rated: 100V
C54 = 0603YW106MAT2A: CAP CER 10UF 16V X6S 0603; manufacturer: KYOCERA AVX; Tolerance: ±20%; Part Number: 0603YW106MAT2A; Capacitance: 10 µF; Applications: General Purpose; componentlink2description: DigiKey Link; componentlink2url: https://www.digikey.com/en/products/detail/kyocera-avx/0603YW106MAT2A/16602928; Device Package: 0603 (1608 Metric); lastupdated: 6.04.2026 19:22:07; Lifecycle Status: Active; Minimum Order: 1; Mounting Type: Surface Mount, MLCC; Operating Temperature: -55°C ~ 105°C; Package / Case: 0603 (1608 Metric); packaging: CutTape; partid: 46681; Part Status: Active; price: 0.08; series: KGM - X6S; Size / Dimension: 0.063" L x 0.031" W (1.60mm x 0.80mm); Supplier 1: DigiKey; Supplier Part Number 1: 478-KGM15CS61C106MTCT-ND; Temperature Coefficient: X6S; Thickness (Max): 0.039" (1.00mm); value: 10 µF; Voltage - Rated: 16V
D11 D12 = LED: as D7 on sheet POWER_4; Footprint: LED_SMD:LED_0603_1608Metric; Manufacturer Part Number: LTST-C191KGKT; Supplier Part Number: 160-1446-1-ND; Value: LTST-C191KGKT
L2 = IHLP2525CZER8R2M01_1: 8.2 µH Shielded Molded Inductor 4 A 68mOhm Max Nonstandard; Order Code: Digi: 541-1012-2-ND; Manufacturer Part Number: IHLP2525CZER8R2M01; LCSC Manufacturer Part Number: IHLP2525CZER8R2M01; LCSC Part Number: C506576
R43 R44 = RMCF0603FT110K: as R34 on sheet POWER_3; Part Number: RMCF0603FT110K; Value: 110 kOhms; ComponentLink1Description: Datasheet; ComponentLink1URL: https://www.seielect.com/catalog/sei-packaging.pdf; ComponentLink2Description: DigiKey Link; ComponentLink2URL: https://www.digikey.com/en/products/detail/stackpole-electronics-inc/RMCF0603FT110K/1761310; Composition: Thick Film; Device Package: 0603 (1608 Metric); Features: Automotive AEC-Q200; Height - Seated (Max): 0.022" (0.55mm); LastUpdated: 9.02.2024 20:43:13; Lifecycle Status: Active; Minimum Order: 1; Number of Terminations: 2; Operating Temperature: -55°C ~ 155°C; Package / Case: 0603 (1608 Metric); Packaging: CutTape; PartId: 10728; Part Status: Active; Price: 0.01; Ratings: AEC-Q200; Resistance: 110 kOhms; Series: RMCF; Size / Dimension: 0.061" L x 0.031" W (1.55mm x 0.80mm); Supplier 1: DigiKey; Supplier Part Number 1: RMCF0603FT110KCT-ND; Supplier Device Package: 0603; Tolerance: ±1%
R45 = RMCF0603FT24K9: RES 24.9K OHM 1% 1/10W 0603; Manufacturer: Stackpole Electronics Inc; Power (Watts): 0.1W, 1/10W; Temperature Coefficient: ±100ppm/°C; Part Number: RMCF0603FT24K9; Value: 24.9 kOhms; ComponentLink1Description: Datasheet; ComponentLink1URL: https://www.seielect.com/catalog/sei-rmcf_rmcp.pdf; ComponentLink2Description: DigiKey Link; ComponentLink2URL: https://www.digikey.com/en/products/detail/stackpole-electronics-inc/RMCF0603FT24K9/1760847; Composition: Thick Film; Device Package: 0603 (1608 Metric); Features: Automotive AEC-Q200; Height - Seated (Max): 0.022" (0.55mm); LastUpdated: 9.02.2024 20:43:13; Lifecycle Status: Active; Minimum Order: 1; Number of Terminations: 2; Operating Temperature: -55°C ~ 155°C; Package / Case: 0603 (1608 Metric); Packaging: CutTape; PartId: 10847; Part Status: Active; Price: 0.01; Ratings: AEC-Q200; Resistance: 24.9 kOhms; Series: RMCF; Size / Dimension: 0.061" L x 0.031" W (1.55mm x 0.80mm); Supplier 1: DigiKey; Supplier Part Number 1: RMCF0603FT24K9CT-ND; Supplier Device Package: 0603; Tolerance: ±1%
R46 = RMCF0603FT2K20: RES 2.2K OHM 1% 1/10W 0603; Manufacturer: Stackpole Electronics Inc; Power (Watts): 0.1W, 1/10W; Temperature Coefficient: ±100ppm/°C; Part Number: RMCF0603FT2K20; Value: 2.2 kOhms; ComponentLink1Description: Datasheet; ComponentLink1URL: https://www.seielect.com/catalog/sei-packaging.pdf; ComponentLink2Description: DigiKey Link; ComponentLink2URL: https://www.digikey.com/en/products/detail/stackpole-electronics-inc/RMCF0603FT2K20/1760987; Composition: Thick Film; Device Package: 0603 (1608 Metric); Features: Automotive AEC-Q200; Height - Seated (Max): 0.022" (0.55mm); LastUpdated: 9.02.2024 20:43:32; Lifecycle Status: Active; Minimum Order: 1; Number of Terminations: 2; Operating Temperature: -55°C ~ 155°C; Package / Case: 0603 (1608 Metric); Packaging: CutTape; PartId: 6089; Part Status: Active; Price: 0.01; Ratings: AEC-Q200; Resistance: 2.2 kOhms; Series: RMCF; Size / Dimension: 0.061" L x 0.031" W (1.55mm x 0.80mm); Supplier 1: DigiKey; Supplier Part Number 1: RMCF0603FT2K20CT-ND; Supplier Device Package: 0603; Tolerance: ±1%
R47 = RMCF0603FG1K00: as R40 on sheet POWER_3; Part Number: RMCF0603FG1K00; Value: 1 kOhms; ComponentLink1Description: Datasheet; ComponentLink1URL: https://www.seielect.com/catalog/sei-packaging.pdf; ComponentLink2Description: DigiKey Link; ComponentLink2URL: https://www.digikey.com/en/products/detail/stackpole-electronics-inc/RMCF0603FG1K00/1713699; Composition: Thick Film; Device Package: 0603 (1608 Metric); Features: Automotive AEC-Q200; Height - Seated (Max): 0.022" (0.55mm); LastUpdated: 9.02.2024 20:42:15; Lifecycle Status: Active; Minimum Order: 1; Number of Terminations: 2; Operating Temperature: -55°C ~ 155°C; Package / Case: 0603 (1608 Metric); Packaging: CutTape; PartId: 24034; Part Status: Active; Price: 0.01; Ratings: AEC-Q200; Resistance: 1 kOhms; Series: RMCF; Size / Dimension: 0.061" L x 0.031" W (1.55mm x 0.80mm); Supplier 1: DigiKey; Supplier Part Number 1: RMCF0603FG1K00CT-ND; Supplier Device Package: 0603; Tolerance: ±1%
R48 = RMCF0603FT10K0: as R39 on sheet POWER_3; Part Number: RMCF0603FT10K0; Value: 10 kOhms; ComponentLink1Description: Datasheet; ComponentLink1URL: https://www.seielect.com/catalog/sei-rmcf_rmcp.pdf; ComponentLink2Description: DigiKey Link; ComponentLink2URL: https://www.digikey.com/en/products/detail/stackpole-electronics-inc/RMCF0603FT10K0/1761235; Composition: Thick Film; Device Package: 0603 (1608 Metric); Features: Automotive AEC-Q200; Height - Seated (Max): 0.022" (0.55mm); LastUpdated: 9.02.2024 20:42:00; Lifecycle Status: Active; Minimum Order: 1; Number of Terminations: 2; Operating Temperature: -55°C ~ 155°C; Package / Case: 0603 (1608 Metric); Packaging: CutTape; PartId: 25663; Part Status: Active; Price: 0.01; Ratings: AEC-Q200; Resistance: 10 kOhms; Series: RMCF; Size / Dimension: 0.061" L x 0.031" W (1.55mm x 0.80mm); Supplier 1: DigiKey; Supplier Part Number 1: RMCF0603FT10K0CT-ND; Supplier Device Package: 0603; Tolerance: ±1%
U11 = TLV75733PDRVR: 1-A, low-IQ high-accuracy low-dropout (LDO) voltage regulator with enable; MF: Texas Instruments; SnapEDA_Link: https://www.snapeda.com/parts/TLV75733PDRVR/Texas+Instruments/view-part/?ref=snap; Package: WSON-6 Texas Instruments; Value: *; MP: TLV75733PDRVR; Check_prices: https://www.snapeda.com/parts/TLV75733PDRVR/Texas+Instruments/view-part/?ref=eda
U12 = LMR33630ADDAR: SIMPLE SWITCHERÂ® 3.8V to 36V, 3A Synchronous Buck Converter With Ultra-Low EMI; MF: Texas Instruments; SnapEDA_Link: https://www.snapeda.com/parts/LMR33630ADDAR/Texas+Instruments/view-part/?ref=snap; Package: HSOIC-8 Texas Instruments; Value: *; MP: LMR33630ADDAR; Check_prices: https://www.snapeda.com/parts/LMR33630ADDAR/Texas+Instruments/view-part/?ref=eda